# EAGLE schematic expender (EAGLE 7.5.0)
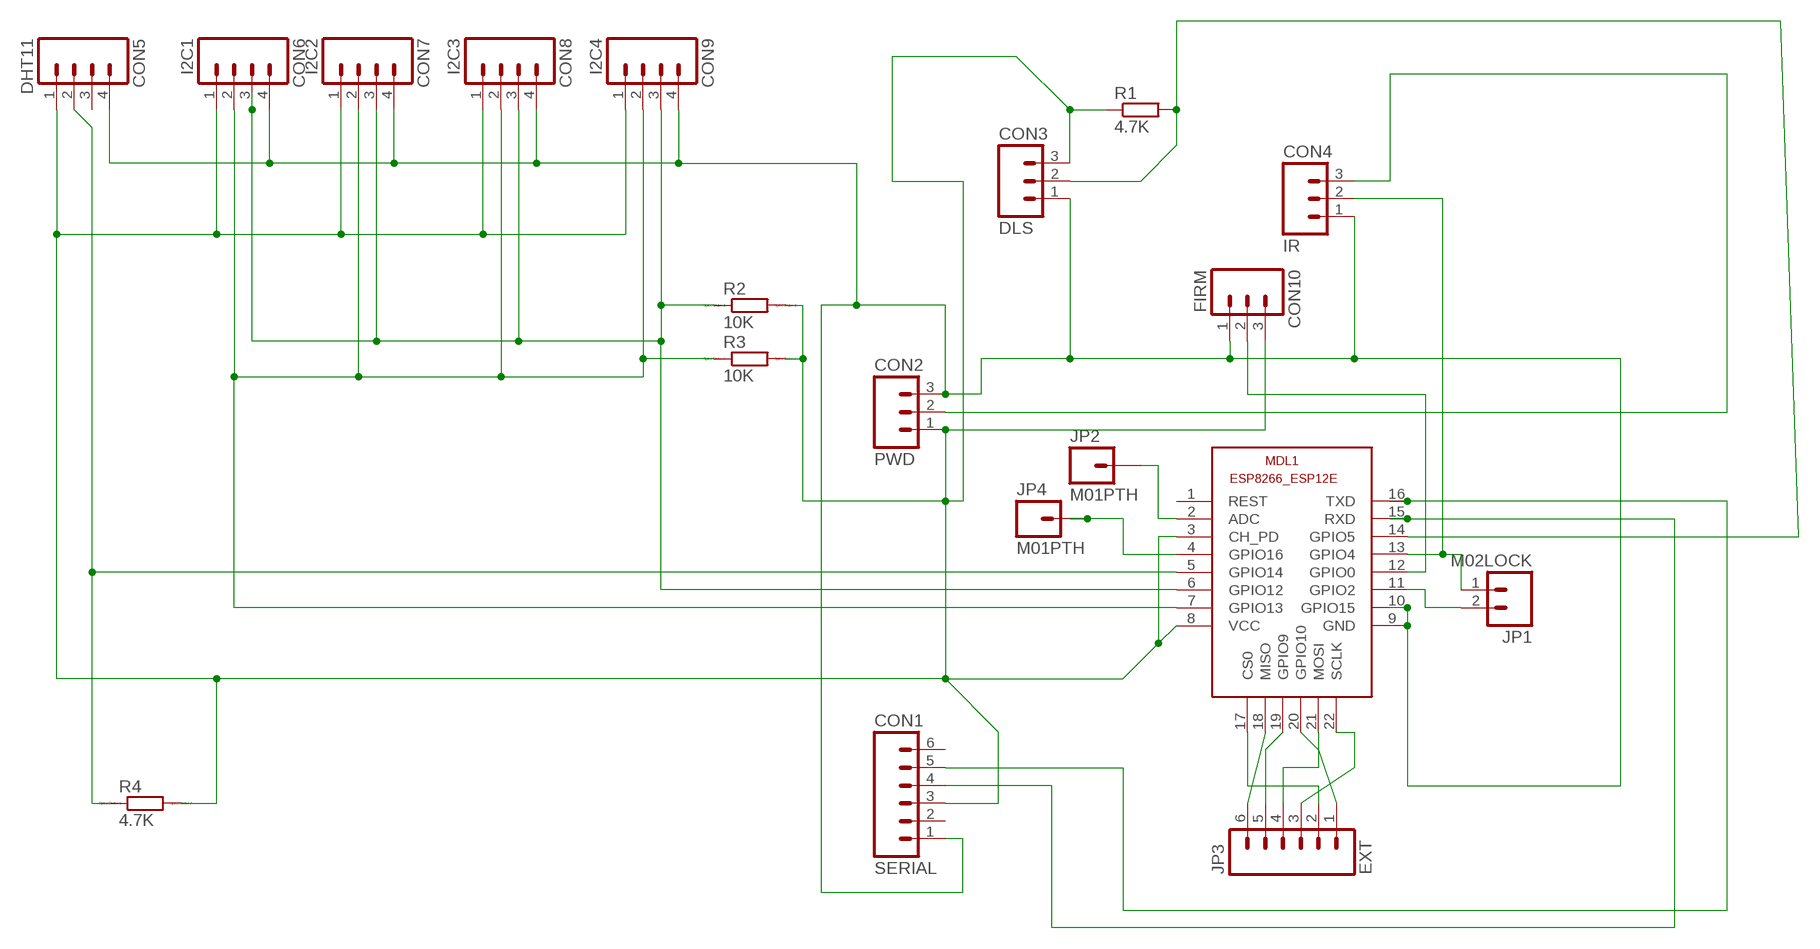
[diagram p0: schematic, sheet 1]

## Parts
CON1  SERIAL  M06LOCK  [1X06_LOCK]
CON2  PWD  M03LOCK  [1X03_LOCK]
CON3  DLS  M03LOCK  [1X03_LOCK]
CON4  IR  M03LOCK  [1X03_LOCK]
CON5  DHT11  M04LOCK  [1X04_LOCK]
CON6  I2C1  M04LOCK  [1X04_LOCK]
CON7  I2C2  M04LOCK  [1X04_LOCK]
CON8  I2C3  M04LOCK  [1X04_LOCK]
CON9  I2C4  M04LOCK  [1X04_LOCK]
CON10  FIRM  M03LOCK  [1X03_LOCK]
JP1  M02LOCK  [1X02_LOCK]
JP2  M01PTH  [1X01]
JP3  EXT  M06LOCK  [1X06_LOCK]
JP4  M01PTH  [1X01]
MDL1  ESP12E  ESP8266-12EESP8266-ESP12E  [ESP8266-ESP12E]
R1  4.7K  R-EU_0207/10  [0207/10]
R2  10K  R0207/10  [0207/10]
R3  10K  R0207/10  [0207/10]
R4  4.7K  RR1206  [R1206]

## Nets
GND [Power]: CON1.1 CON2.3 CON3.1 CON4.1 CON5.4 CON6.4 CON7.4 CON8.4 CON9.4 CON10.1 MDL1.9(GND) MDL1.10(GPIO15)
N$1: CON5.2 MDL1.5(GPIO14) R4.1
N$2: CON3.2 MDL1.14(GPIO5) R1.2
N$3: CON10.2 MDL1.12(GPIO0)
N$4 [Power]: CON2.2 CON4.3
N$6: JP1.2 MDL1.11(GPIO2)
N$7: CON4.2 JP1.1 MDL1.13(GPIO4)
N$8: JP2.1 MDL1.2(ADC)
N$9: JP3.2 MDL1.17(CS0)
N$10 [Signal]: JP3.6 MDL1.18(MISO)
N$11: JP3.5 MDL1.19(GPIO9)
N$12: JP3.1 MDL1.20(GPIO10)
N$13: JP3.4 MDL1.21(MOSI)
N$14: JP3.3 MDL1.22(SCLK)
N$15: CON1.5 MDL1.16(TXD)
N$16: CON1.4 MDL1.15(RXD)
N$17: JP4.1 MDL1.4(GPIO16)
SDA [Signal]: CON6.2 CON7.2 CON8.2 CON9.2 MDL1.7(GPIO13) R3.1
SDL [Signal]: CON6.3 CON7.3 CON8.3 CON9.3 MDL1.6(GPIO12) R2.1
VCC+3V [Power]: CON1.3 CON2.1 CON3.3 CON5.1 CON6.1 CON7.1 CON8.1 CON9.1 CON10.3 MDL1.3(CH_PD) MDL1.8(VCC) R1.1 R2.2 R3.2 R4.2
Unconnected: CON1.2 CON1.6 CON5.3 MDL1.1(REST)

## Library data of the parts
CON1 JP3 = SparkFun-Connectors:M06: Header 6 Standard 6-pin 0.1" header. Use with straight break away headers (SKU : PRT-00116), right angle break away headers (PRT-00553), swiss pins (PRT-00743), machine pins (PRT-00117), and female headers (PRT-00115). Molex polarized connector foot print use with SKU : PRT-08094 with associated crimp pins and housings. NOTES ON THE VARIANTS LOCK and LOCK_LONGPADS... This footprint was designed to help hold the alignment of a through-hole component (i.e. 6-pin header) while soldering it into place. You may notice that each hole has been shifted either up or down by 0.005 of an inch from it's more standard position (which is a perfectly straight line). This slight alteration caused the pins (the squares in the middle) to touch the edges of the holes. Because they are alternating, it causes a "brace" to hold the component in place. 0.005 has proven to be the perfect amount of "off-center" position when using our standard breakaway headers. Although looks a little odd when you look at the bare footprint, once you have a header in there, the alteration is very hard to notice. Also,if you push a header all the way into place, it is covered up entirely on the bottom side. This idea of altering the position of holes to aid alignment will be further integrated into the Sparkfun Library for other footprints. It can help hold any component with 3 or more connection pins.
CON2-CON4 CON10 = SparkFun-Connectors:M03: Header 3 Standard 3-pin 0.1" header. Use with straight break away headers (SKU : PRT-00116), right angle break away headers (PRT-00553), swiss pins (PRT-00743), machine pins (PRT-00117), and female headers (PRT-00115). Molex polarized connector foot print use with SKU : PRT-08232 with associated crimp pins and housings.
CON5-CON9 = SparkFun-Connectors:M04: Header 4 Standard 4-pin 0.1" header. Use with straight break away headers (SKU : PRT-00116), right angle break away headers (PRT-00553), swiss pins (PRT-00743), machine pins (PRT-00117), and female headers (PRT-00115). Molex polarized connector foot print use with SKU : PRT-08231 with associated crimp pins and housings. 1MM SMD Version SKU: PRT-10208
JP1 = SparkFun-Connectors:M02: Standard 2-pin 0.1" header. Use with - straight break away headers ( PRT-00116) - right angle break away headers (PRT-00553) - swiss pins (PRT-00743) - machine pins (PRT-00117) - female headers (PRT-00115) Molex polarized connector foot print use with: PRT-08233 with associated crimp pins and housings. 2.54_SCREWTERM for use with PRT-10571. 3.5mm Screw Terminal footprints for PRT-08084 5mm Screw Terminal footprints for use with PRT-08432
JP2 JP4 = SparkFun-Connectors:M01: Header 1 Standard 1-pin 0.1" header. Use with straight break away headers (SKU : PRT-00116), right angle break away headers (PRT-00553), swiss pins (PRT-00743), machine pins (PRT-00117), and female headers (PRT-00115).
MDL1 = ESP8266-ESP12E:ESP8266-12E: ESP8266-12E with additional I/O and GPIO04/05 corrected The author cannot warrant that this library is free from error or will meet your specific requirements. Created by PuceBaboon.com. Komagane, Nagano, JAPAN
R1 = resistor:R-EU_: RESISTOR, European symbol
R2-R4 = eagle-ltspice:R: RESISTOR, European symbol; SPICEMODEL: NONE; SPICEPREFIX: R

## Net classes
1 Power: width 0.762 mm
2 Signal: width 0.203 mm